# Altium project МЦТР.00010592.00.002.PrjPcb
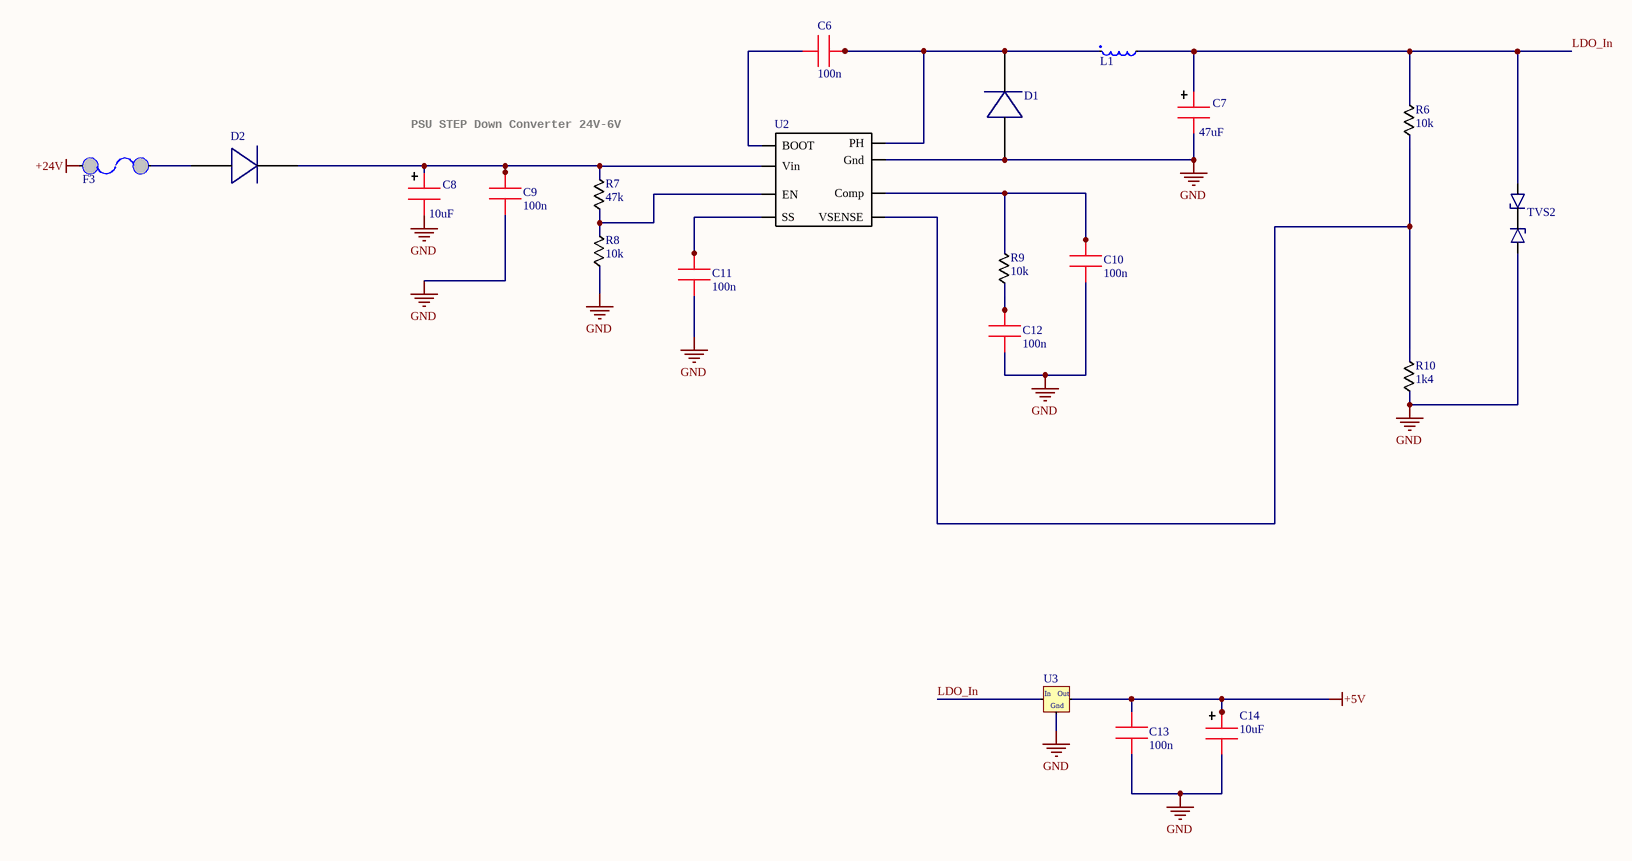
[diagram p0: PSU.SchDoc]
5 sheets, 159 parts. Net scope: global (net labels, ports and power ports of the same name join across sheets).
Board file: 讨倚.00010592.00.002.PcbDoc
Sheets:
  PSU.SchDoc
  DI_24V_DC.SchDoc
  LEDs.SchDoc
  RS485.SchDoc
  Plugs.SchDoc

## Sheet PSU.SchDoc
size A3

### Parts
C6  100n  [0603_CAP]
C7  47uF  [1206_CAP]
C9  100n  [0603_CAP]
C10  100n  [0603_CAP]
C11  100n  [0603_CAP]
C12  100n  [0603_CAP]
C13  100n  [0603_CAP]
C14  10uF  [1206_CAP]
D1  (no value)  [B340A-13-F]
D2  (no value)  [B340A-13-F]
F3  Fuse PTS  [Fuse USMF030]  (value not drawn)
L1  33u  [SRU1048]  (value not drawn)
R6  10k  [0603_RES]
R7  47k  [0603_RES]
R8  10k  [0603_RES]
R9  10k  [0603_RES]
R10  1k4  [0603_RES]
TVS2  (no value)  [DO-214AC]
U2  (no value)  [SOIC 8]
U3  (no value)  [SOT223]
С8  10uF  [1206_CAP]

### Nets
+5V: C13.1 C14.1 U3.2(OUT)
+24V: F3.0
GND: C7.2 C9.1 C10.1 C11.1 C12.1 C13.2 C14.2 D1.1(A) R8.1 R10.1 TVS2.1 U2.7(Gnd) U3.1(GND) С8.2
LDO_In: C7.1 L1.2 R6.2 TVS2.2 U3.3(IN)
NetC6_1: C6.1 U2.1(BOOT)
NetC6_2: C6.2 D1.2(C) L1.1 U2.8(PH)
NetC9_2: C9.2 D2.1(C) R7.2 U2.2(Vin) С8.1
NetC10_2: C10.2 R9.2 U2.6(Comp)
NetC11_2: C11.2 U2.4(SS)
NetC12_2: C12.2 R9.1
NetD2_2: D2.2(A) F3.1
NetR6_1: R6.1 R10.2 U2.5(VSENSE)
NetR7_1: R7.1 R8.2 U2.3(EN)

### Notes on the sheet
- PSU STEP Down Converter 24V-6V
- (in symbol NCV1117ST50T3G) In; Out; Gnd

### Library data of the parts
C6 C9-C13 = 0603 CAP: Part Description: Capacitor 0.1uF X7R 0603 10%; Part Number: CC0603KRX7R9BB104
C7 = 1206 Cap El: Part Description: 47 uF 10 VDC 10% 1210 X7R; Part Number: GRM32ER71A476KE15L
C14 = 1206 Cap El: Part Description: Ceramic Capacitor 10UF 50V 10% 1210; Part Number: GRM32ER71H106KA12L
D1 D2 = B340A-13-F: Part Description: Schottky Diodes & Rectifiers 60V 3A; Part Number: B360A-13-F
F3 = Fuse PTS: Part Description: PPTC 30V 50MA; Part Number: MF-USMF005-2
L1 = CDRH127: Part Description: 33uH 30% SMD 1048; Part Number: SRU1048-330Y
R6 R8 R9 = Resistor 0805: Part Description: Resistor 0603, 10kOhms, 1%, 1/10W; Part Number: RC0603FR-0710KL
R7 = Resistor 0805: Part Description: Resistor 0603, 47kOhms, 5%, 1/10W; Part Number: RC0603JR-0747K
R10 = Resistor 0805: Part Description: Resistor 0603, 1.4kOhms, 1%, 1/10W; Part Number: RC0603FR-071K4L
TVS2 = SM6T: Part Description: TVS Diodes 600W 12V Bidirect; Part Number: SM6T12CA
U2 = TPS54331: Part Description: Switching Voltage Regulators 3A 28V In Step Down SWIFT DC/DC; Part Number: TPS54331
U3 = NCV1117ST50T3G: Part Description: LDO Voltage Regulators 5 V; Part Number: LM1117MPX-5.0
С8 = 1206 Cap El: Part Description: Ceramic Capacitor 10uF X5R 1206 10%; Part Number: CC1206KKX5R9BB106

## Sheet DI_24V_DC.SchDoc
size A3
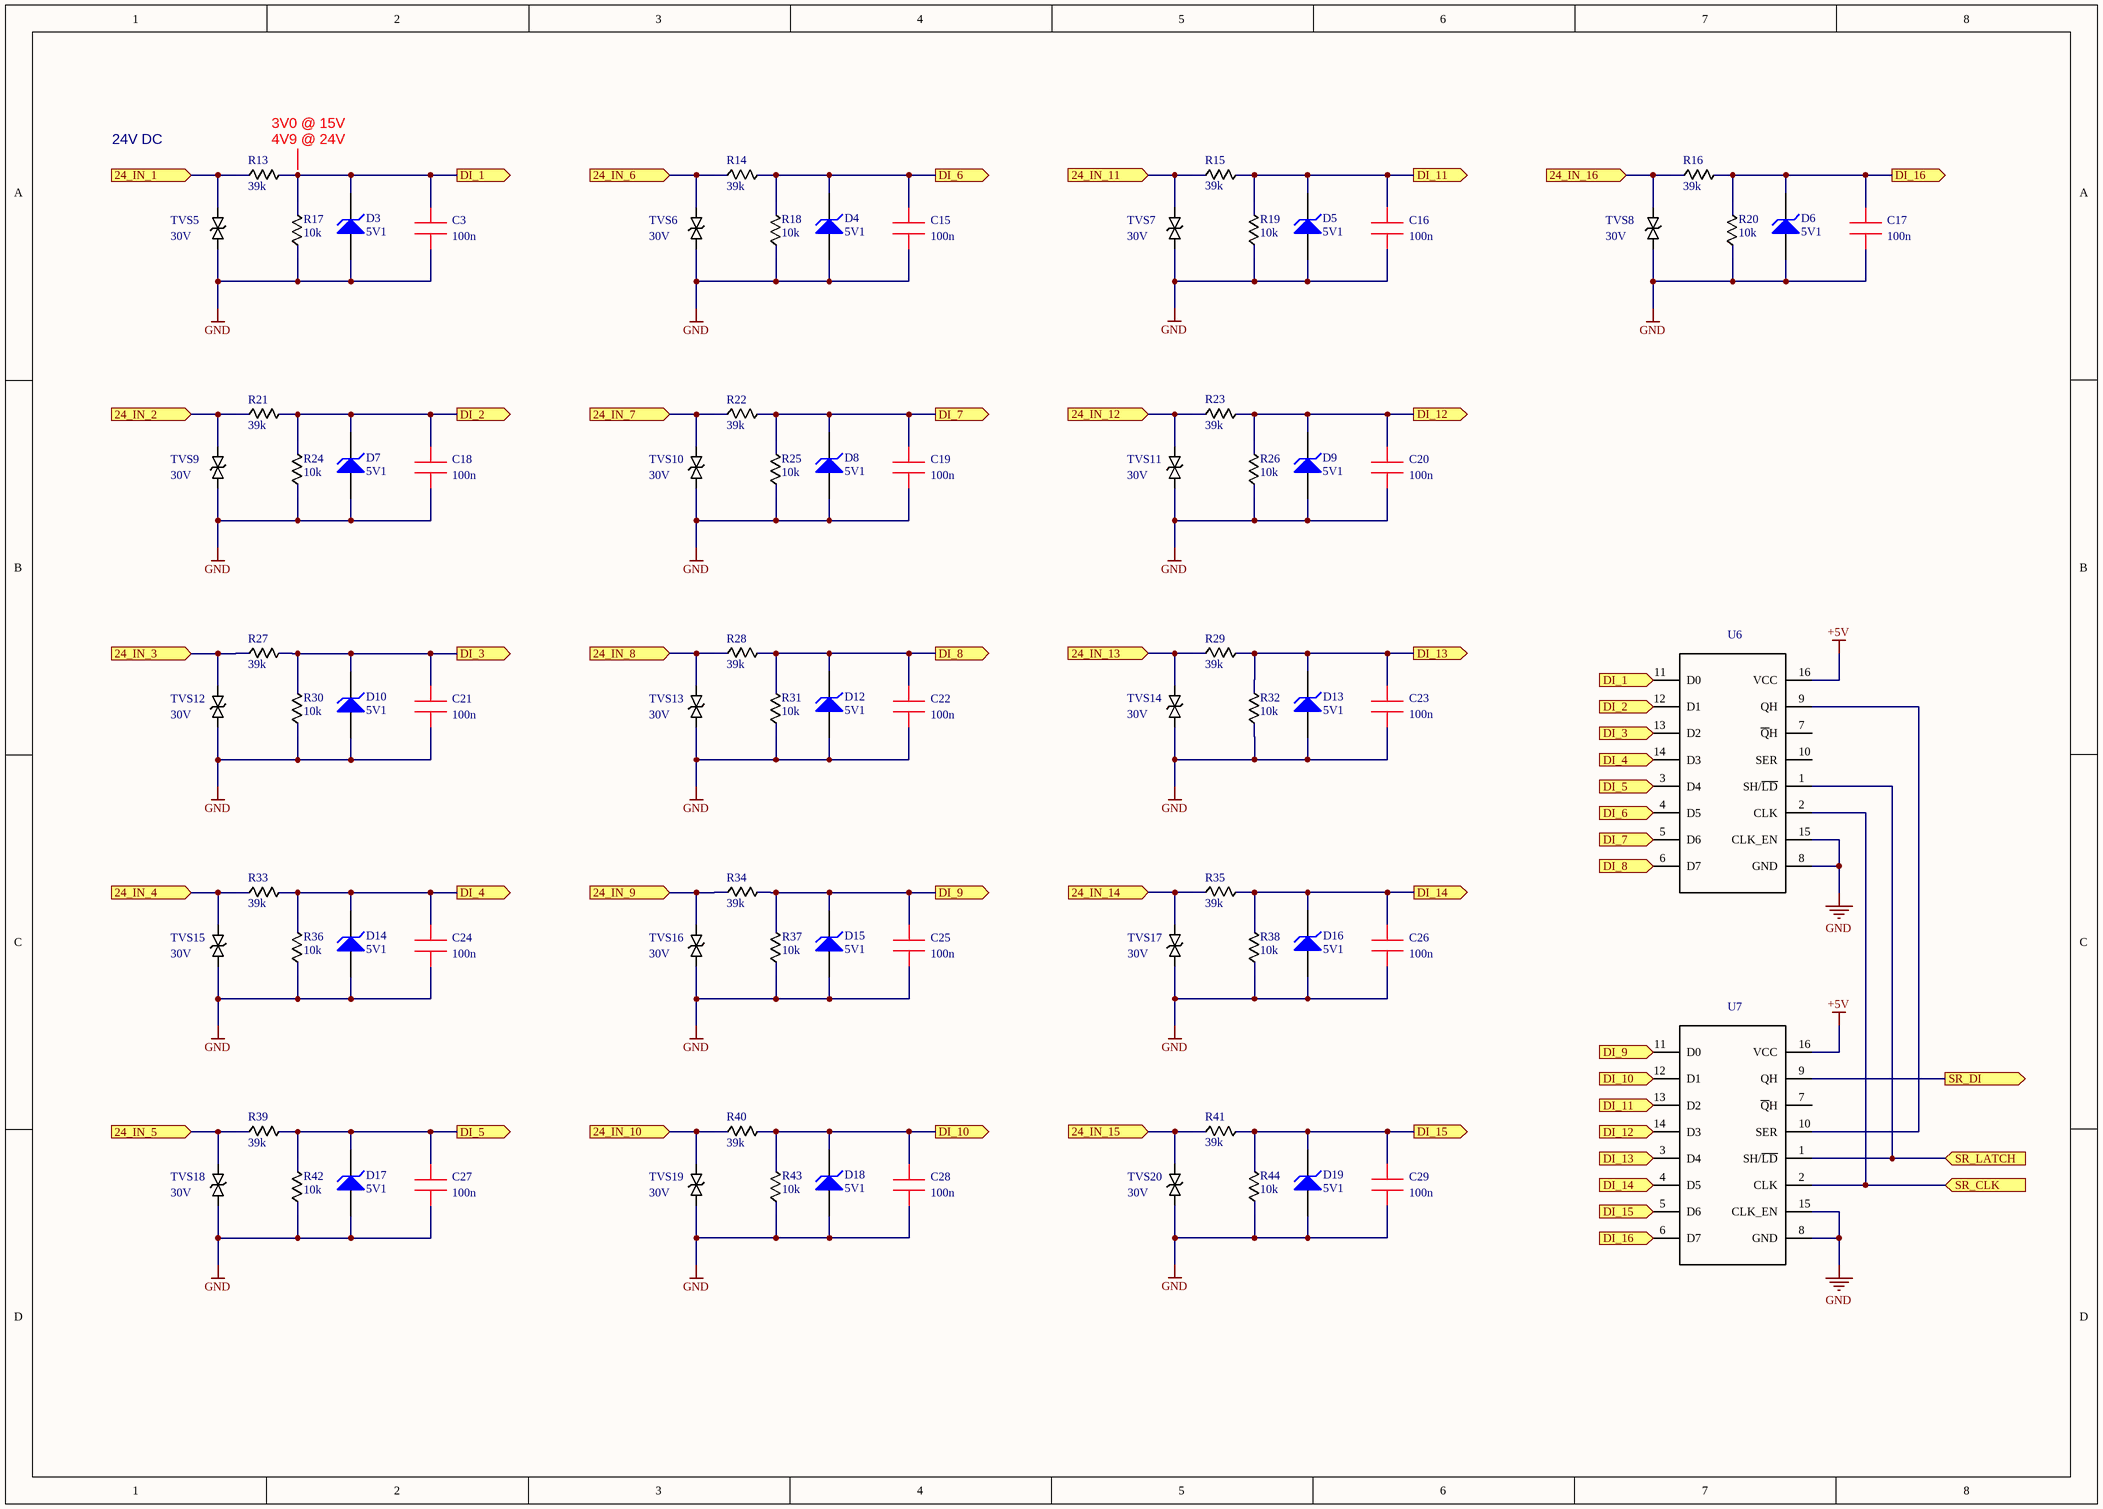
[diagram p1: DI_24V_DC.SchDoc]

### Parts
C3  100n  [0603_CAP]
C15  100n  [0603_CAP]
C16  100n  [0603_CAP]
C17  100n  [0603_CAP]
C18  100n  [0603_CAP]
C19  100n  [0603_CAP]
C20  100n  [0603_CAP]
C21  100n  [0603_CAP]
C22  100n  [0603_CAP]
C23  100n  [0603_CAP]
C24  100n  [0603_CAP]
C25  100n  [0603_CAP]
C26  100n  [0603_CAP]
C27  100n  [0603_CAP]
C28  100n  [0603_CAP]
C29  100n  [0603_CAP]
D3  5V1  [SOT23]
D4  5V1  [SOT23]
D5  5V1  [SOT23]
D6  5V1  [SOT23]
D7  5V1  [SOT23]
D8  5V1  [SOT23]
D9  5V1  [SOT23]
D10  5V1  [SOT23]
D12  5V1  [SOT23]
D13  5V1  [SOT23]
D14  5V1  [SOT23]
D15  5V1  [SOT23]
D16  5V1  [SOT23]
D17  5V1  [SOT23]
D18  5V1  [SOT23]
D19  5V1  [SOT23]
R13  39k  [0603_RES]
R14  39k  [0603_RES]
R15  39k  [0603_RES]
R16  39k  [0603_RES]
R17  10k  [0603_RES]
R18  10k  [0603_RES]
R19  10k  [0603_RES]
R20  10k  [0603_RES]
R21  39k  [0603_RES]
R22  39k  [0603_RES]
R23  39k  [0603_RES]
R24  10k  [0603_RES]
R25  10k  [0603_RES]
R26  10k  [0603_RES]
R27  39k  [0603_RES]
R28  39k  [0603_RES]
R29  39k  [0603_RES]
R30  10k  [0603_RES]
R31  10k  [0603_RES]
R32  10k  [0603_RES]
R33  39k  [0603_RES]
R34  39k  [0603_RES]
R35  39k  [0603_RES]
R36  10k  [0603_RES]
R37  10k  [0603_RES]
R38  10k  [0603_RES]
R39  39k  [0603_RES]
R40  39k  [0603_RES]
R41  39k  [0603_RES]
R42  10k  [0603_RES]
R43  10k  [0603_RES]
R44  10k  [0603_RES]
TVS5  30V  [DO-214AC]
TVS6  30V  [DO-214AC]
TVS7  30V  [DO-214AC]
TVS8  30V  [DO-214AC]
TVS9  30V  [DO-214AC]
TVS10  30V  [DO-214AC]
TVS11  30V  [DO-214AC]
TVS12  30V  [DO-214AC]
TVS13  30V  [DO-214AC]
TVS14  30V  [DO-214AC]
TVS15  30V  [DO-214AC]
TVS16  30V  [DO-214AC]
TVS17  30V  [DO-214AC]
TVS18  30V  [DO-214AC]
TVS19  30V  [DO-214AC]
TVS20  30V  [DO-214AC]
U6  (no value)  [SOIC 16]
U7  (no value)  [SOIC 16]

### Ports
24_IN_1, 24_IN_2, 24_IN_3, 24_IN_4, 24_IN_5, 24_IN_6, 24_IN_7, 24_IN_8, 24_IN_9, 24_IN_10, 24_IN_11, 24_IN_12, 24_IN_13, 24_IN_14, 24_IN_15, 24_IN_16, DI_1, DI_2, DI_3, DI_4, DI_5, DI_6, DI_7, DI_8, DI_9, DI_10, DI_11, DI_12, DI_13, DI_14, DI_15, DI_16, SR_CLK, SR_DI, SR_LATCH

### Nets
+5V: U6.16(VCC) U7.16(VCC)
GND: C3.1 C15.1 C16.1 C17.1 C18.1 C19.1 C20.1 C21.1 C22.1 C23.1 C24.1 C25.1 C26.1 C27.1 C28.1 C29.1 D3.1(A) D4.1(A) D5.1(A) D6.1(A) D7.1(A) D8.1(A) D9.1(A) D10.1(A) D12.1(A) D13.1(A) D14.1(A) D15.1(A) D16.1(A) D17.1(A) D18.1(A) D19.1(A) R17.1 R18.1 R19.1 R20.1 R24.1 R25.1 R26.1 R30.1 R31.1 R32.1 R36.1 R37.1 R38.1 R42.1 R43.1 R44.1 TVS5.1 TVS6.1 TVS7.1 TVS8.1 TVS9.1 TVS10.1 TVS11.1 TVS12.1 TVS13.1 TVS14.1 TVS15.1 TVS16.1 TVS17.1 TVS18.1 TVS19.1 TVS20.1 U6.8(GND) U6.15(CLK_EN) U7.8(GND) U7.15(CLK_EN)
24_IN_1: R13.1 TVS5.2 ; port 24_IN_1
24_IN_2: R21.1 TVS9.2 ; port 24_IN_2
24_IN_3: R27.1 TVS12.2 ; port 24_IN_3
24_IN_4: R33.1 TVS15.2 ; port 24_IN_4
24_IN_5: R39.1 TVS18.2 ; port 24_IN_5
24_IN_6: R14.1 TVS6.2 ; port 24_IN_6
24_IN_7: R22.1 TVS10.2 ; port 24_IN_7
24_IN_8: R28.1 TVS13.2 ; port 24_IN_8
24_IN_9: R34.1 TVS16.2 ; port 24_IN_9
24_IN_10: R40.1 TVS19.2 ; port 24_IN_10
24_IN_11: R15.1 TVS7.2 ; port 24_IN_11
24_IN_12: R23.1 TVS11.2 ; port 24_IN_12
24_IN_13: R29.1 TVS14.2 ; port 24_IN_13
24_IN_14: R35.1 TVS17.2 ; port 24_IN_14
24_IN_15: R41.1 TVS20.2 ; port 24_IN_15
24_IN_16: R16.1 TVS8.2 ; port 24_IN_16
DI_1: C3.2 D3.2(K) R13.2 R17.2 U6.11(D0) ; port DI_1
DI_2: C18.2 D7.2(K) R21.2 R24.2 U6.12(D1) ; port DI_2
DI_3: C21.2 D10.2(K) R27.2 R30.2 U6.13(D2) ; port DI_3
DI_4: C24.2 D14.2(K) R33.2 R36.2 U6.14(D3) ; port DI_4
DI_5: C27.2 D17.2(K) R39.2 R42.2 U6.3(D4) ; port DI_5
DI_6: C15.2 D4.2(K) R14.2 R18.2 U6.4(D5) ; port DI_6
DI_7: C19.2 D8.2(K) R22.2 R25.2 U6.5(D6) ; port DI_7
DI_8: C22.2 D12.2(K) R28.2 R31.2 U6.6(D7) ; port DI_8
DI_9: C25.2 D15.2(K) R34.2 R37.2 U7.11(D0) ; port DI_9
DI_10: C28.2 D18.2(K) R40.2 R43.2 U7.12(D1) ; port DI_10
DI_11: C16.2 D5.2(K) R15.2 R19.2 U7.13(D2) ; port DI_11
DI_12: C20.2 D9.2(K) R23.2 R26.2 U7.14(D3) ; port DI_12
DI_13: C23.2 D13.2(K) R29.2 R32.2 U7.3(D4) ; port DI_13
DI_14: C26.2 D16.2(K) R35.2 R38.2 U7.4(D5) ; port DI_14
DI_15: C29.2 D19.2(K) R41.2 R44.2 U7.5(D6) ; port DI_15
DI_16: C17.2 D6.2(K) R16.2 R20.2 U7.6(D7) ; port DI_16
SR_CLK: U6.2(CLK) U7.2(CLK) ; port SR_CLK
SR_DI: U7.9(QH) ; port SR_DI
SR_LATCH: U6.1(SH/~{LD}) U7.1(SH/~{LD}) ; port SR_LATCH
NetU6_9: U6.9(QH) U7.10(SER)

Not connected (* = marked no-connect by the designer): U6 7(~{Q}H) 10(SER); U7 7(~{Q}H)

### Notes on the sheet
- 24V DC
- (near R13) 4V9 @ 24V
- (near R13) 3V0 @ 15V

### Library data of the parts
C3 C15-C29 = 0603 CAP: as C6 on sheet PSU
D3-D10 D12-D19 = D Zener: pin to pad: 2>3; Part Description: Zener Diodes 5.1V 250mW; Part Number: BZX84C5V1LT1G
R13-R16 R21-R23 R27-R29 R33-R35 R39-R41 = 0603 RES: RC0603FR-0739KL; Part Description: Resistor 0603, 39kOhms, 1%, 1/10W; Part Number: RC0603FR-0739KL
R17-R20 R24-R26 R30-R32 R36-R38 R42-R44 = 0603 RES: Part Description: Resistor 0603, 10kOhms, 1%, 1/10W; Part Number: RC0603FR-0710KL
TVS5-TVS20 = TVS: Part Description: TVS Diodes 400W 30V 5% Bi-Directional; Part Number: SMAJ30CA
U6 U7 = 74HC165: Part Description: Counter Shift Register; Part Number: 74HC165D.653

## Sheet LEDs.SchDoc
size A4
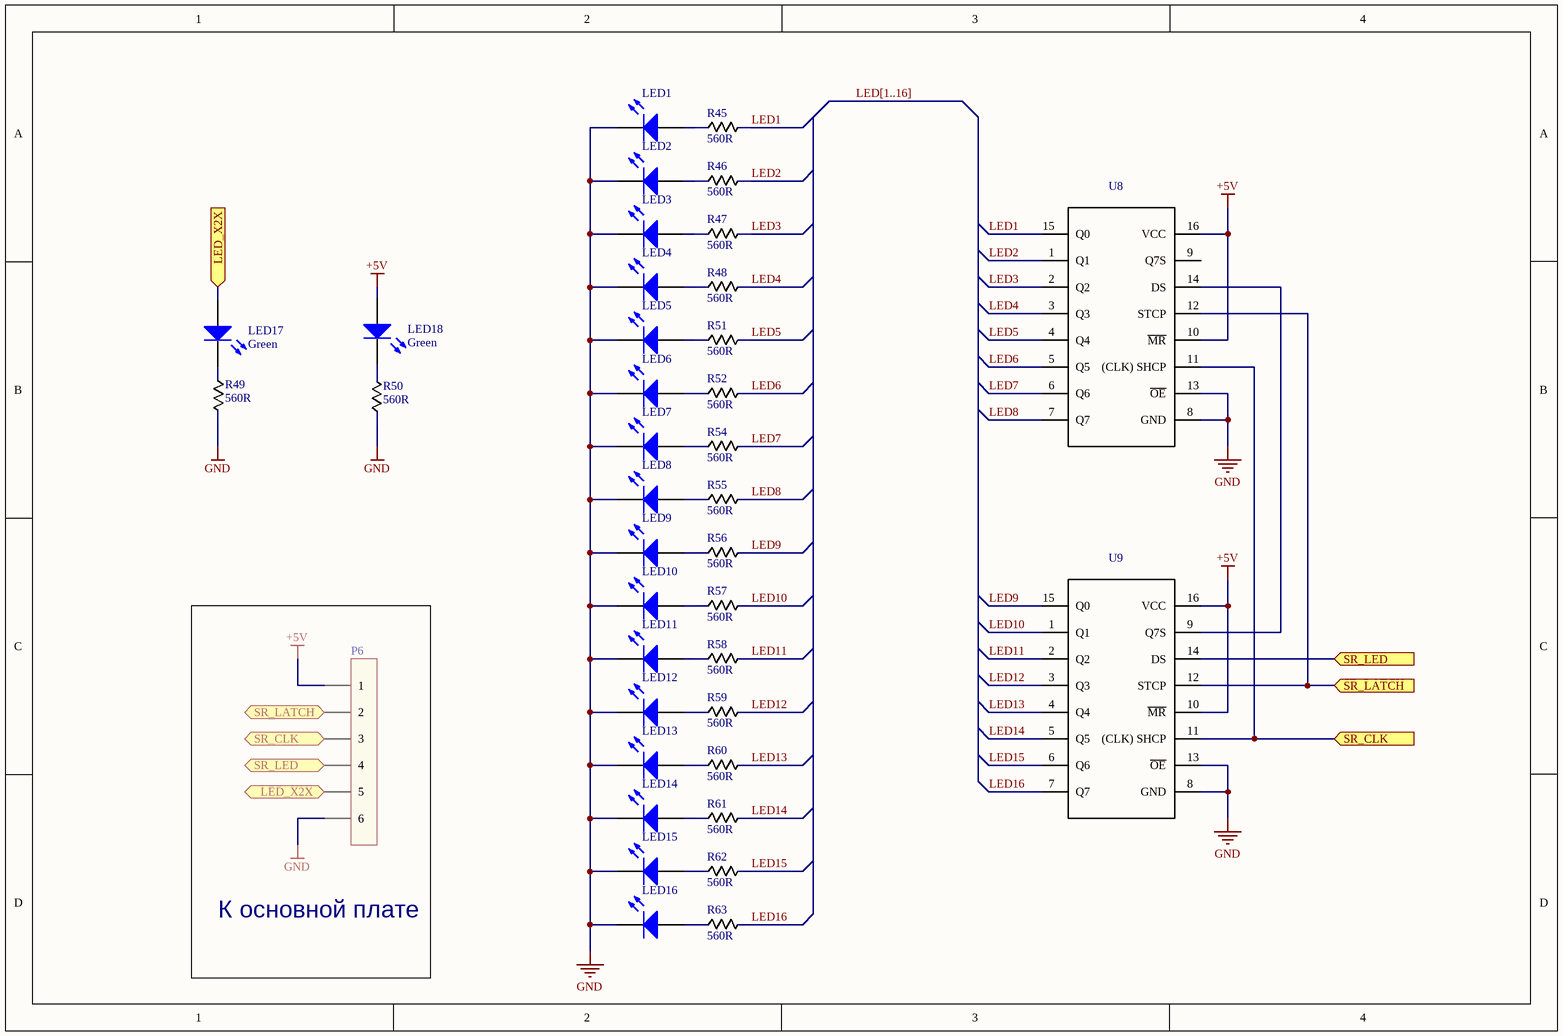
[diagram p2: LEDs.SchDoc]

### Parts
LED1  Green  [LED SMD 0603]  (value not drawn)
LED2  Green  [LED SMD 0603]  (value not drawn)
LED3  Green  [LED SMD 0603]  (value not drawn)
LED4  Green  [LED SMD 0603]  (value not drawn)
LED5  Green  [LED SMD 0603]  (value not drawn)
LED6  Green  [LED SMD 0603]  (value not drawn)
LED7  Green  [LED SMD 0603]  (value not drawn)
LED8  Green  [LED SMD 0603]  (value not drawn)
LED9  Green  [LED SMD 0603]  (value not drawn)
LED10  Green  [LED SMD 0603]  (value not drawn)
LED11  Green  [LED SMD 0603]  (value not drawn)
LED12  Green  [LED SMD 0603]  (value not drawn)
LED13  Green  [LED SMD 0603]  (value not drawn)
LED14  Green  [LED SMD 0603]  (value not drawn)
LED15  Green  [LED SMD 0603]  (value not drawn)
LED16  Green  [LED SMD 0603]  (value not drawn)
LED17  Green  [LED SMD 0603]
LED18  Green  [LED SMD 0603]
P6  (no value)  [PLS-6 2.54]
R45  560R  [0603_RES]
R46  560R  [0603_RES]
R47  560R  [0603_RES]
R48  560R  [0603_RES]
R49  560R  [0603_RES]
R50  560R  [0603_RES]
R51  560R  [0603_RES]
R52  560R  [0603_RES]
R54  560R  [0603_RES]
R55  560R  [0603_RES]
R56  560R  [0603_RES]
R57  560R  [0603_RES]
R58  560R  [0603_RES]
R59  560R  [0603_RES]
R60  560R  [0603_RES]
R61  560R  [0603_RES]
R62  560R  [0603_RES]
R63  560R  [0603_RES]
U8  (no value)  [SOIC 16]
U9  (no value)  [SOIC 16]

### Blocks framed on the sheet
К основной плате: P6

### Ports
LED_X2X, SR_CLK, SR_LATCH, SR_LED

### Nets
+5V: LED18.1(A) P6.1 U8.10(~{MR}) U8.16(VCC) U9.10(~{MR}) U9.16(VCC)
GND: LED1.2(K) LED2.2(K) LED3.2(K) LED4.2(K) LED5.2(K) LED6.2(K) LED7.2(K) LED8.2(K) LED9.2(K) LED10.2(K) LED11.2(K) LED12.2(K) LED13.2(K) LED14.2(K) LED15.2(K) LED16.2(K) P6.6 R49.2 R50.1 U8.8(GND) U8.13(~{OE}) U9.8(GND) U9.13(~{OE})
LED1: R45.2 U8.15(Q0)
LED2: R46.2 U8.1(Q1)
LED3: R47.2 U8.2(Q2)
LED4: R48.2 U8.3(Q3)
LED5: R51.2 U8.4(Q4)
LED6: R52.2 U8.5(Q5)
LED7: R54.2 U8.6(Q6)
LED8: R55.2 U8.7(Q7)
LED9: R56.2 U9.15(Q0)
LED10: R57.2 U9.1(Q1)
LED11: R58.2 U9.2(Q2)
LED12: R59.2 U9.3(Q3)
LED13: R60.2 U9.4(Q4)
LED14: R61.2 U9.5(Q5)
LED15: R62.2 U9.6(Q6)
LED16: R63.2 U9.7(Q7)
LED_X2X: LED17.1(A) P6.5 ; port LED_X2X
SR_CLK: P6.3 U8.11((CLK)_SHCP) U9.11((CLK)_SHCP) ; port SR_CLK
SR_LATCH: P6.2 U8.12(STCP) U9.12(STCP) ; port SR_LATCH
SR_LED: P6.4 U9.14(DS) ; port SR_LED
NetLED1_1: LED1.1(A) R45.1
NetLED2_1: LED2.1(A) R46.1
NetLED3_1: LED3.1(A) R47.1
NetLED4_1: LED4.1(A) R48.1
NetLED5_1: LED5.1(A) R51.1
NetLED6_1: LED6.1(A) R52.1
NetLED7_1: LED7.1(A) R54.1
NetLED8_1: LED8.1(A) R55.1
NetLED9_1: LED9.1(A) R56.1
NetLED10_1: LED10.1(A) R57.1
NetLED11_1: LED11.1(A) R58.1
NetLED12_1: LED12.1(A) R59.1
NetLED13_1: LED13.1(A) R60.1
NetLED14_1: LED14.1(A) R61.1
NetLED15_1: LED15.1(A) R62.1
NetLED16_1: LED16.1(A) R63.1
NetLED17_2: LED17.2(K) R49.1
NetLED18_2: LED18.2(K) R50.2
NetU8_14: U8.14(DS) U9.9(Q7S)

Not connected (* = marked no-connect by the designer): U8 9(Q7S)

### Buses and harness runs
bus LED[1..16]

### Library data of the parts
LED1-LED18 = 0603 LED: Part Description: Single Colour LED Green; Part Number: KP-1608SGC
P6 = PLS-6: Part Number: PLS-6
R45-R52 R54-R63 = 0603 RES: Part Description: Resistor 0603, 560Ohms, 5%, 1/10W; Part Number: RC0603JR-07560RL
U8 U9 = 74HC595: Part Description: 8-Bit Shift DDRister/Latch; Part Number: 74HC595D.118

## Sheet RS485.SchDoc
size A4
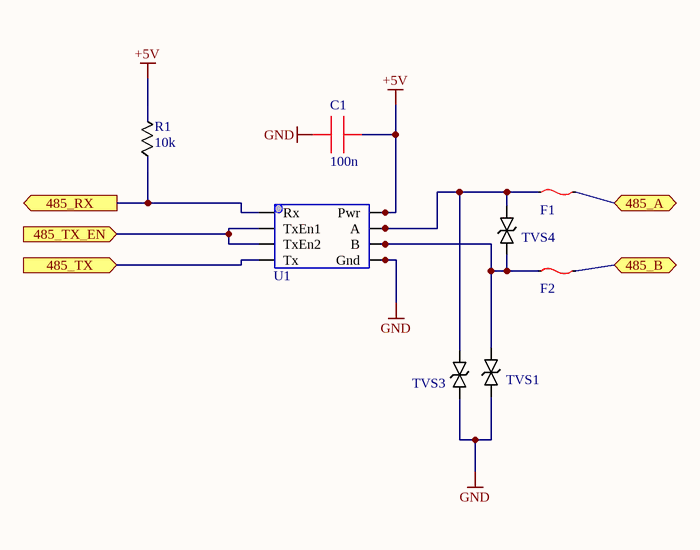
[diagram p3: RS485.SchDoc]

### Parts
C1  100n  [0603_CAP]
F1  Fuse PTS  [1210_MF]  (value not drawn)
F2  Fuse PTS  [1210_MF]  (value not drawn)
R1  10k  [0603_RES]
TVS1  6V  [DO-214AC]  (value not drawn)
TVS3  6V  [DO-214AC]  (value not drawn)
TVS4  6V  [DO-214AC]  (value not drawn)
U1  MAX485  [SOIC 8]  (value not drawn)

### Ports
485_A, 485_B, 485_RX, 485_TX, 485_TX_EN

### Nets
+5V: C1.1 R1.2 U1.8(Pwr)
GND: C1.2 TVS1.1 TVS3.1 U1.5(Gnd)
485_A: F1.2 ; port 485_A
485_B: F2.2 ; port 485_B
485_RX: R1.1 U1.1(Rx) ; port 485_RX
485_TX: U1.4(Tx) ; port 485_TX
485_TX_EN: U1.2(TxEn1) U1.3(TxEn2) ; port 485_TX_EN
NetF1_1: F1.1 TVS3.2 TVS4.2 U1.7(A)
NetF2_1: F2.1 TVS1.2 TVS4.1 U1.6(B)

### Library data of the parts
C1 = 0603 CAP: as C6 on sheet PSU
F1 F2 = MSMF: Part Description: PPTC 60V 100MA; Part Number: MF-MSMF010-2
R1 = Resistor 0805: as R6 on sheet PSU
TVS1 TVS3 TVS4 = SMAJ5.0CA: Part Description: TVS Diodes 6volts 800/1600uA 38.8 Amps Bi-Dir; Part Number: SMAJ6.0CA
U1 = MAX485: Part Description: RS-485 Interface IC Low-Power; Part Number: SN65HVD3082EDR

## Sheet Plugs.SchDoc
size A4
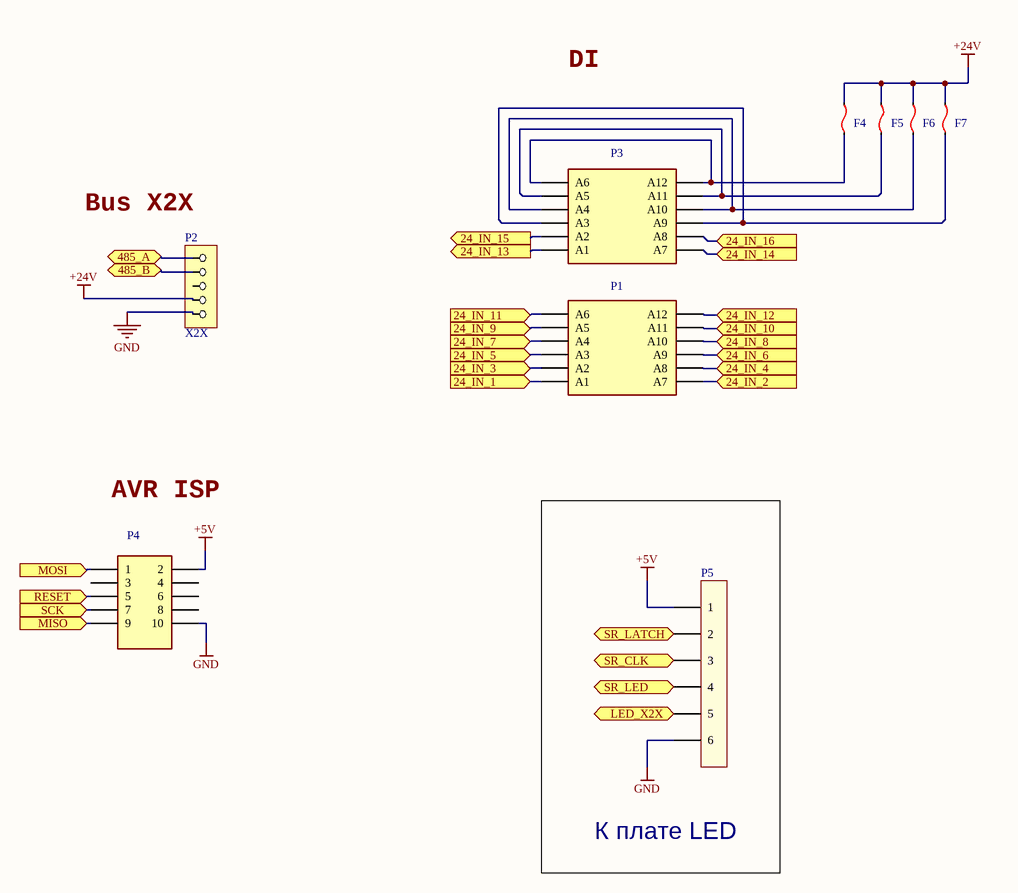
[diagram p4: Plugs.SchDoc]

### Parts
F4  Fuse PTS  [1210_MF]  (value not drawn)
F5  Fuse PTS  [1210_MF]  (value not drawn)
F6  Fuse PTS  [1210_MF]  (value not drawn)
F7  Fuse PTS  [1210_MF]  (value not drawn)
P1  MCD 1.5/6 Phoenix  [mcd 1,5/6-G1-3.81]  (value not drawn)
P2  X2X  [MSTBA 1757271]
P3  (no value)  [mcd 1,5/6-G1-3.81]
P4  (no value)  [IDC-10MS]
P5  (no value)  [PLS-6 2.54]

### Blocks framed on the sheet
К плате LED: P5

### Ports
24_IN_1, 24_IN_2, 24_IN_3, 24_IN_4, 24_IN_5, 24_IN_6, 24_IN_7, 24_IN_8, 24_IN_9, 24_IN_10, 24_IN_11, 24_IN_12, 24_IN_13, 24_IN_14, 24_IN_15, 24_IN_16, 485_A, 485_B, LED_X2X, MISO, MOSI, RESET, SCK, SR_CLK, SR_LATCH, SR_LED

### Nets
+5V: P4.2 P5.1
+24V: F4.1 F5.1 F6.1 F7.1 P2.4
GND: P2.5 P4.10 P5.6
24_IN_1: P1.11(A1) ; port 24_IN_1
24_IN_2: P1.12(A7) ; port 24_IN_2
24_IN_3: P1.9(A2) ; port 24_IN_3
24_IN_4: P1.10(A8) ; port 24_IN_4
24_IN_5: P1.7(A3) ; port 24_IN_5
24_IN_6: P1.8(A9) ; port 24_IN_6
24_IN_7: P1.5(A4) ; port 24_IN_7
24_IN_8: P1.6(A10) ; port 24_IN_8
24_IN_9: P1.3(A5) ; port 24_IN_9
24_IN_10: P1.4(A11) ; port 24_IN_10
24_IN_11: P1.1(A6) ; port 24_IN_11
24_IN_12: P1.2(A12) ; port 24_IN_12
24_IN_13: P3.11(A1) ; port 24_IN_13
24_IN_14: P3.12(A7) ; port 24_IN_14
24_IN_15: P3.9(A2) ; port 24_IN_15
24_IN_16: P3.10(A8) ; port 24_IN_16
485_A: P2.1 ; port 485_A
485_B: P2.2 ; port 485_B
LED_X2X: P5.5 ; port LED_X2X
MISO: P4.9 ; port MISO
MOSI: P4.1 ; port MOSI
RESET: P4.5 ; port RESET
SCK: P4.7 ; port SCK
SR_CLK: P5.3 ; port SR_CLK
SR_LATCH: P5.2 ; port SR_LATCH
SR_LED: P5.4 ; port SR_LED
NetF4_2: F4.2 P3.1(A6) P3.2(A12)
NetF5_2: F5.2 P3.3(A5) P3.4(A11)
NetF6_2: F6.2 P3.5(A4) P3.6(A10)
NetF7_2: F7.2 P3.7(A3) P3.8(A9)

Not connected (* = marked no-connect by the designer): P2 3; P4 3 4 6 8

### Notes on the sheet
- DI
- (near P2) Bus X2X
- AVR ISP

### Library data of the parts
F4-F7 = MSMF: as F1 on sheet RS485
P2 = EMSTBA 2.5/5-G-5.08: Part Number: EMSTBA 2.5/5-G-5.08
P3 = MCD 1.5/6 Phoenix: Part Number: MCD 1.5/6 Phoenix
P4 = IDC-10MS: Part Number: DS1013-10SSIB1-B-0
P5 = PLS-6: Part Number: PLS-6
P1 = MCD 1.5/6 Phoenix: Part Number: MCD 1.5/6 Phoenix

## Nets that join several sheets
+5V: PSU (C13.1 C14.1 U3.2), DI_24V_DC (U6.16 U7.16), LEDs (6 pins), RS485 (C1.1 R1.2 U1.8), Plugs (P4.2 P5.1)
+24V: PSU (F3.0), Plugs (5 pins)
GND: PSU (14 pins), DI_24V_DC (68 pins), LEDs (23 pins), RS485 (C1.2 TVS1.1 TVS3.1 U1.5), Plugs (P2.5 P4.10 P5.6)
24_IN_1: DI_24V_DC (R13.1 TVS5.2), Plugs (P1.11)
24_IN_2: DI_24V_DC (R21.1 TVS9.2), Plugs (P1.12)
24_IN_3: DI_24V_DC (R27.1 TVS12.2), Plugs (P1.9)
24_IN_4: DI_24V_DC (R33.1 TVS15.2), Plugs (P1.10)
24_IN_5: DI_24V_DC (R39.1 TVS18.2), Plugs (P1.7)
24_IN_6: DI_24V_DC (R14.1 TVS6.2), Plugs (P1.8)
24_IN_7: DI_24V_DC (R22.1 TVS10.2), Plugs (P1.5)
24_IN_8: DI_24V_DC (R28.1 TVS13.2), Plugs (P1.6)
24_IN_9: DI_24V_DC (R34.1 TVS16.2), Plugs (P1.3)
24_IN_10: DI_24V_DC (R40.1 TVS19.2), Plugs (P1.4)
24_IN_11: DI_24V_DC (R15.1 TVS7.2), Plugs (P1.1)
24_IN_12: DI_24V_DC (R23.1 TVS11.2), Plugs (P1.2)
24_IN_13: DI_24V_DC (R29.1 TVS14.2), Plugs (P3.11)
24_IN_14: DI_24V_DC (R35.1 TVS17.2), Plugs (P3.12)
24_IN_15: DI_24V_DC (R41.1 TVS20.2), Plugs (P3.9)
24_IN_16: DI_24V_DC (R16.1 TVS8.2), Plugs (P3.10)
485_A: RS485 (F1.2), Plugs (P2.1)
485_B: RS485 (F2.2), Plugs (P2.2)
LED_X2X: LEDs (LED17.1 P6.5), Plugs (P5.5)
SR_CLK: DI_24V_DC (U6.2 U7.2), LEDs (P6.3 U8.11 U9.11), Plugs (P5.3)
SR_LATCH: DI_24V_DC (U6.1 U7.1), LEDs (P6.2 U8.12 U9.12), Plugs (P5.2)
SR_LED: LEDs (P6.4 U9.14), Plugs (P5.4)